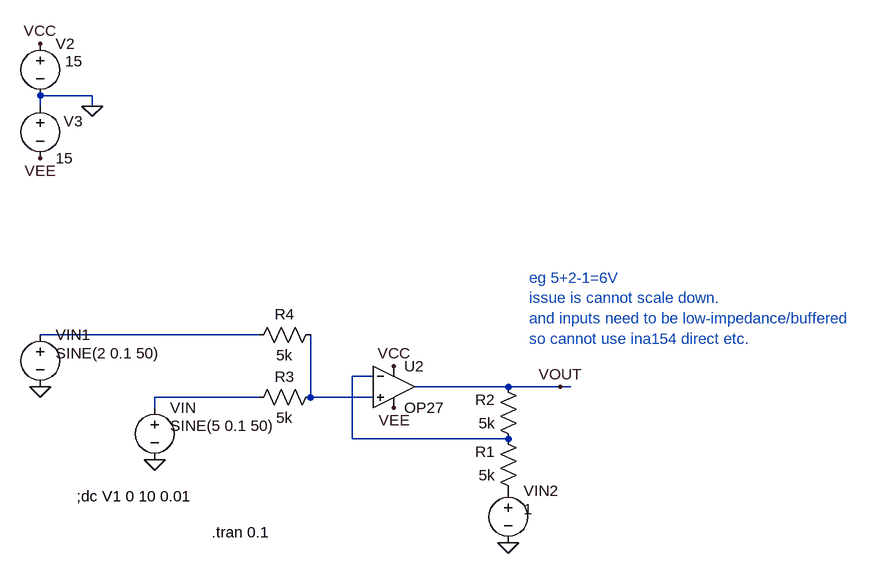
[diagram p0: schematic Draft22.asc]
Draft22.asc, the LTspice schematic file:
Version 4
SHEET 1 1172 680
WIRE -48 -352 -128 -352
WIRE -128 -336 -128 -352
WIRE -48 -336 -48 -352
WIRE 208 16 -128 16
WIRE 384 80 352 80
WIRE 592 96 448 96
WIRE 672 96 592 96
WIRE 688 96 672 96
WIRE 208 112 48 112
WIRE 288 112 288 16
WIRE 384 112 288 112
WIRE 48 128 48 112
WIRE 352 176 352 80
WIRE 592 176 352 176
FLAG 48 208 0
FLAG -48 -336 0
FLAG 672 96 VOUT
FLAG -128 -432 VCC
FLAG 416 64 VCC
FLAG -128 -256 VEE
FLAG 416 128 VEE
FLAG 592 336 0
FLAG -128 96 0
SYMBOL voltage 48 112 R0
WINDOW 123 0 0 Left 0
WINDOW 39 0 0 Left 0
WINDOW 3 24 44 Left 2
SYMATTR Value SINE(5 0.1 50)
SYMATTR InstName VIN
SYMBOL voltage -128 -448 R0
WINDOW 123 0 0 Left 0
WINDOW 39 0 0 Left 0
WINDOW 3 38 43 Left 2
SYMATTR Value 15
SYMATTR InstName V2
SYMBOL voltage -128 -352 R0
WINDOW 123 0 0 Left 0
WINDOW 39 0 0 Left 0
WINDOW 0 36 39 Left 2
SYMATTR InstName V3
SYMATTR Value 15
SYMBOL res 608 192 R180
WINDOW 0 36 76 Left 2
WINDOW 3 36 40 Left 2
SYMATTR InstName R2
SYMATTR Value 5k
SYMBOL OpAmps\\OP27 416 32 R0
SYMATTR InstName U2
SYMBOL res 608 272 R180
WINDOW 0 36 76 Left 2
WINDOW 3 36 40 Left 2
SYMATTR InstName R1
SYMATTR Value 5k
SYMBOL res 192 128 R270
WINDOW 0 32 56 VTop 2
WINDOW 3 0 56 VBottom 2
SYMATTR InstName R3
SYMATTR Value 5k
SYMBOL res 192 32 R270
WINDOW 0 32 56 VTop 2
WINDOW 3 0 56 VBottom 2
SYMATTR InstName R4
SYMATTR Value 5k
SYMBOL voltage -128 0 R0
WINDOW 123 0 0 Left 0
WINDOW 39 0 0 Left 0
WINDOW 3 24 44 Left 2
SYMATTR Value SINE(2 0.1 50)
SYMATTR InstName VIN1
SYMBOL voltage 592 240 R0
WINDOW 123 0 0 Left 0
WINDOW 39 0 0 Left 0
WINDOW 3 24 44 Left 2
SYMATTR Value 1
SYMATTR InstName VIN2
TEXT -72 264 Left 2 !;dc V1 0 10 0.01
TEXT 136 320 Left 2 !.tran 0.1
TEXT 624 -72 Left 2 ;eg 5+2-1=6V\nissue is cannot scale down.\nand inputs need to be low-impedance/buffered\nso cannot use ina154 direct etc.

The netlist it stands for:
* Draft22.asc
VIN N003 0 SINE(5 0.1 50)
V2 VCC 0 15
V3 0 VEE 15
R2 N002 VOUT 5k
XU2 N004 N002 VCC VEE VOUT OP27  ; pins In+ In- V+ V- OUT
R1 P001 N002 5k
R3 N003 N004 5k
R4 N001 N004 5k
VIN1 N001 0 SINE(2 0.1 50)
VIN2 P001 0 1
;dc V1 0 10 0.01
.tran 0.1
* eg 5+2-1=6V
* issue is cannot scale down.
* and inputs need to be low-impedance/buffered
* so cannot use ina154 direct etc.
.lib ADI.lib
.backanno
.end